# EAGLE design FT232_DIP (EAGLE 5.06)
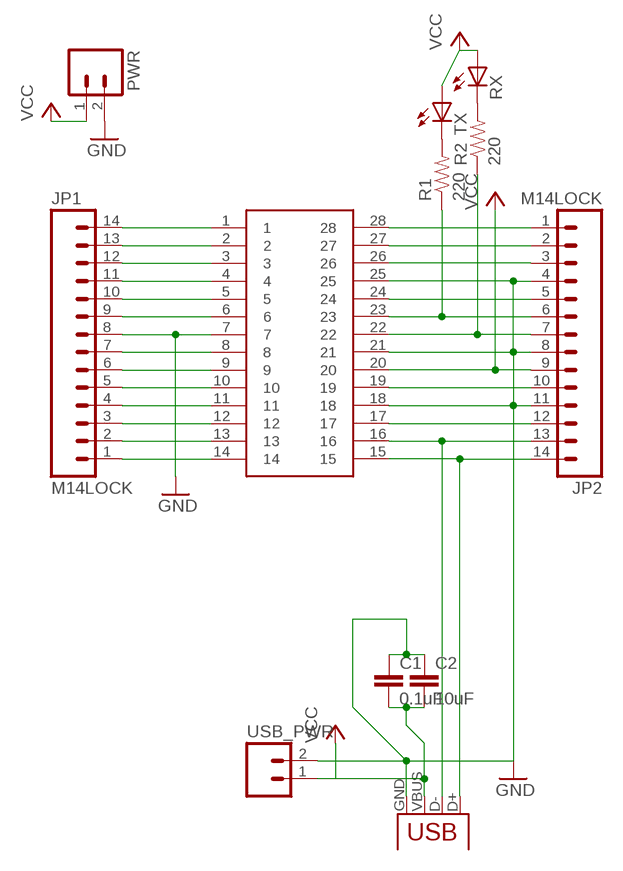
[diagram p0: schematic, sheet 1]

## Parts
C1  0.1uF  CAP0603-CAP  [0603-CAP]
C2  10uF  CAP0603-CAP  [0603-CAP]
JP1  M14LOCK  [1X14_LOCK]
JP2  M14LOCK  [1X14_LOCK]
PWR  M02LOCK  [1X02_LOCK]
R1  220  RESISTOR0603-RES  [0603-RES]
R2  220  RESISTOR0603-RES  [0603-RES]
RX  LED0603  [LED-0603]
TX  LED0603  [LED-0603]
U$1  SSOP28  [SSOP28DB]
USB_PWR  M02LOCK  [1X02_LOCK]
X1  USBSMD  [USB-MINIB]

## Nets
GND: C1.1 C2.1 JP1.8 JP2.4 JP2.8 JP2.11 PWR.2 U$1.7 U$1.18 U$1.21 U$1.25 USB_PWR.2 X1.GND
N$1: JP2.14 U$1.15 X1.D+
N$2: JP2.13 U$1.16 X1.D-
N$3: JP2.7 R2.1 U$1.22
N$5: JP1.1 U$1.14
N$6: JP1.2 U$1.13
N$7: JP1.3 U$1.12
N$8: JP1.4 U$1.11
N$9: JP1.5 U$1.10
N$10: JP1.6 U$1.9
N$11: JP1.7 U$1.8
N$12: JP1.9 U$1.6
N$13: JP1.10 U$1.5
N$14: JP1.11 U$1.4
N$15: JP1.12 U$1.3
N$16: JP1.13 U$1.2
N$17: JP1.14 U$1.1
N$18: JP2.1 U$1.28
N$19: JP2.2 U$1.27
N$20: JP2.3 U$1.26
N$21: JP2.5 U$1.24
N$22: JP2.6 R1.1 U$1.23
N$23: JP2.10 U$1.19
N$24: JP2.12 U$1.17
N$26: R1.2 TX.C
N$27: R2.2 RX.C
VCC: C1.2 C2.2 JP2.9 PWR.1 RX.A TX.A U$1.20 USB_PWR.1 X1.VBUS

## Library data of the parts
C1 C2 = SparkFun:CAP: Capacitor Standard 0603 ceramic capacitor, and 0.1" leaded capacitor.
JP1 JP2 = SparkFun:M14: Header 14 Standard 14-pin 0.1" header. Use with straight break away headers (SKU : PRT-00116), right angle break away headers (PRT-00553), swiss pins (PRT-00743), machine pins (PRT-00117), and female headers (PRT-00115).
PWR USB_PWR = SparkFun:M02: Header 2 Standard 2-pin 0.1" header. Use with straight break away headers (SKU : PRT-00116), right angle break away headers (PRT-00553), swiss pins (PRT-00743), machine pins (PRT-00117), and female headers (PRT-00115). Molex polarized connector foot print use with SKU : PRT-08233 with associated crimp pins and housings.
R1 R2 = SparkFun:RESISTOR: Resistor Basic schematic elements and footprints for 0603, 1206, and PTH 1/10th watt (small) resistors.
RX TX = SparkFun:LED: LEDs Standard schematic elements and footprints for 5mm, 3mm, 1206, and 0603 sized LEDs. 5mm - Spark Fun Electronics SKU : COM-00529 (and others)
U$1 = SparkFun:SSOP28
X1 = SparkFun:USB: USB Connectors USB-B-PTH is fully proven SKU : PRT-00139 USB-miniB is fully proven SKU : PRT-00587 USB-A-PCB is untested. USB-A-H is throughly reviewed, but untested. Spark Fun Electronics SKU : PRT-00437 USB-B-SMT is throughly reviewed, but untested. Needs silkscreen touching up. USB-A-S has not been used/tested USB-MB-H has not been used/tested

## Board
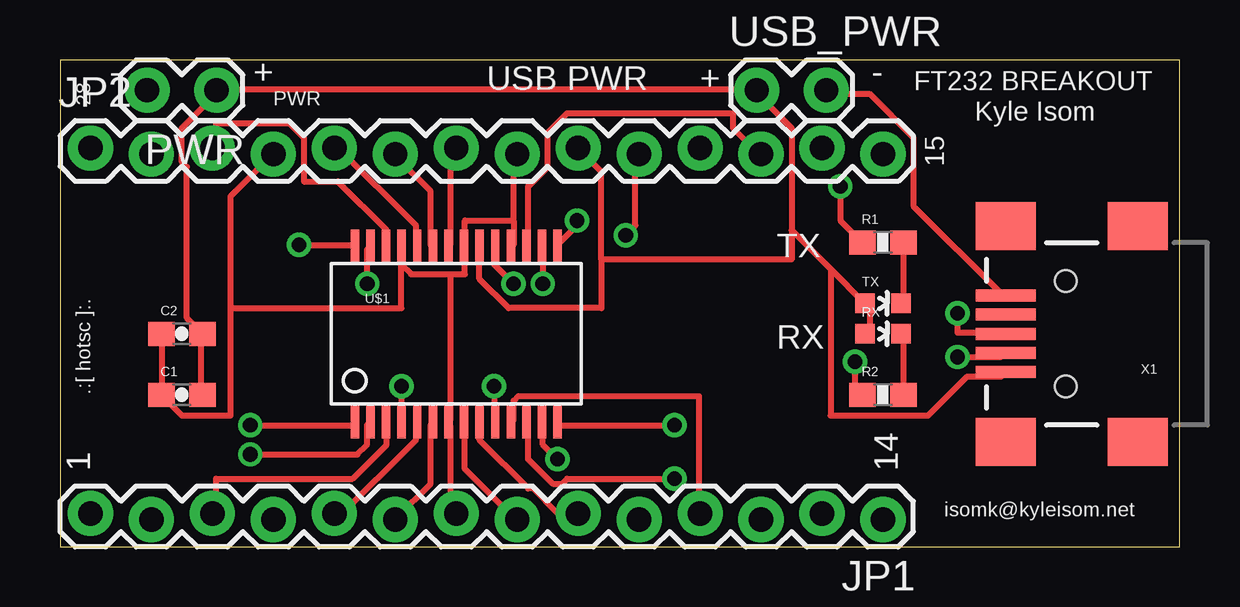
[diagram p1: board, top side]
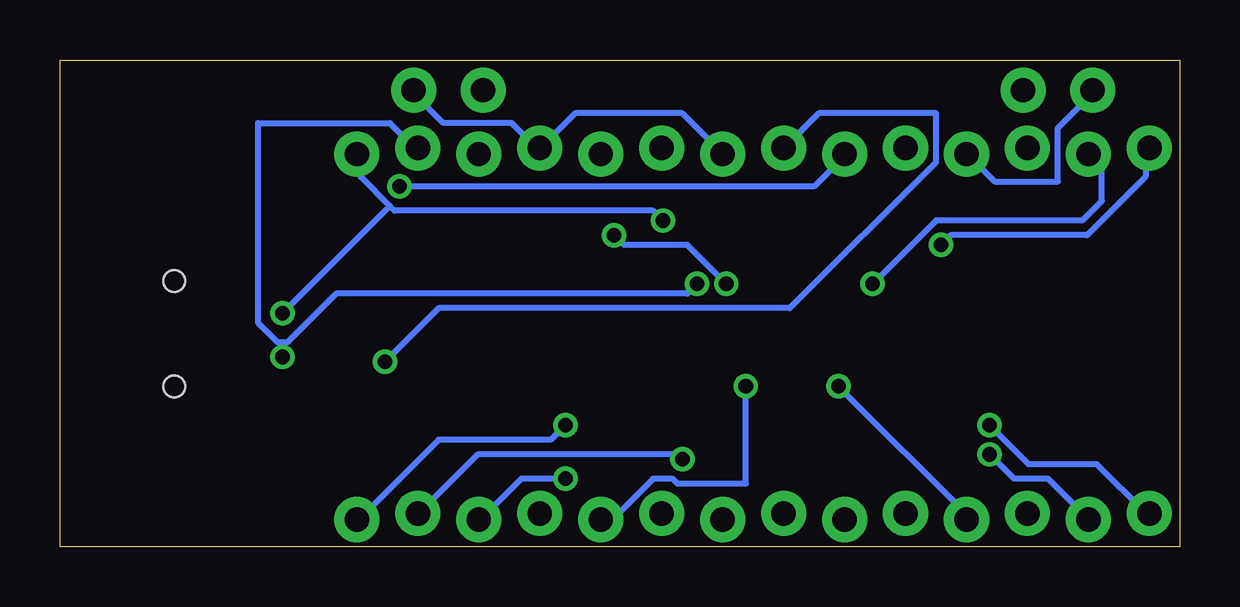
[diagram p2: board, bottom side, seen from below]

Size 46.66 x 20.31 mm. Coordinates in mm from the lower left corner, seen from the top.
Outline: 0,0 46.66,0 46.66,20.31 0,20.31 0,0
Copper layers (1*16): Top 0.035mm / dielectric 1.5mm / Bottom 0.035mm
Design rules "default": minimum track width 10mil, minimum drill 24mil, track to track 8mil, track to pad 8mil, pad to pad 8mil, via to via 8mil, smd to smd 8mil, copper to edge 40mil, drill to drill 8mil, minimum pad ring 10mil, minimum via ring 8mil, stop-mask expansion 4mil, vias tented up to drill 0mil, thermal gap 10mil

### Footprints (pad centres in the part's own frame; a part is rotated, then mirrored left to right if it is on the bottom)
0603-CAP = smd 1.1 x 1: 1 -0.85,0; 2 0.85,0
1X14_LOCK = drill 1.016 pad 1.88 round: 1 0,0.127; 2 2.54,-0.127; 3 5.08,0.127; 4 7.62,-0.127; 5 10.16,0.127; 6 12.7,-0.127; 7 15.24,0.127; 8 17.78,-0.127; 9 20.32,0.127; 10 22.86,-0.127; 11 25.4,0.127; 12 27.94,-0.127; 13 30.48,0.127; 14 33.02,-0.127
1X02_LOCK = drill 1.016 pad 1.88 round: 1 -0.178,0; 2 2.718,0
0603-RES = smd 1.1 x 1: 1 -0.85,0; 2 0.85,0
LED-0603 = smd 0.8 x 0.8: A 0,-0.75; C 0,0.75
SSOP28DB = smd 0.348 x 1.397: 1 -4.225,-3.656; 2 -3.575,-3.656; 3 -2.925,-3.656; 4 -2.275,-3.656; 5 -1.625,-3.656; 6 -0.975,-3.656; 7 -0.325,-3.656; 8 0.325,-3.656; 9 0.975,-3.656; 10 1.625,-3.656; 11 2.275,-3.656; 12 2.925,-3.656; 13 3.575,-3.656; 14 4.225,-3.656; 15 4.225,3.656; 16 3.575,3.656; 17 2.925,3.656; 18 2.275,3.656; 19 1.625,3.656; 20 0.975,3.656; 21 0.325,3.656; 22 -0.325,3.656; 23 -0.975,3.656; 24 -1.625,3.656; 25 -2.275,3.656; 26 -2.925,3.656; 27 -3.575,3.656; 28 -4.225,3.656
USB-MINIB = smd 2.5 x 0.5: D+ 2.5,0; D- 2.5,0.8; GND 2.5,-1.6; ID 2.5,-0.8; VBUS 2.5,1.6 | smd 2.5 x 2: GND@1 -3,-4.5; GND@2 -3,4.5; GND@3 2.5,4.5; GND@4 2.5,-4.5 | hole 0.9: 0,2.2; 0,-2.2

### Placement (x,y rotation side)
C1  5.08,6.35 0 top
C2  5.08,8.89 0 top
JP1  34.29,1.27 180 top
JP2  1.27,16.51 0 top
PWR  6.35,19.05 180 top
R1  34.29,12.7 0 top
R2  34.29,6.35 0 top
RX  34.29,8.89 270 top
TX  34.29,10.16 270 top
U$1  16.51,8.89 0 top
USB_PWR  29.21,19.05 0 top
X1  41.91,8.89 180 top

### Tracks (layer width: path | path; a pad name or v marks a point on that pad's centre or on a via)
GND
  Top 0.254: X1.GND 39.22,10.57 35.56,14.22 35.56,17.07 33.73,18.9 32.11,18.9 USB_PWR.2 | C2.1 4.27,8.74 4.27,6.5 C1.1 4.27,6.3 5.08,5.49 7.11,5.49 7.11,9.96 | 7.11,9.96 7.11,14.63 8.74,16.26 JP2.4 | 18.9,13.61 18.9,16.26 JP2.8 | 18.9,13.61 18.9,12.6 U$1.18 | 14.22,11.79 14.22,12.39 U$1.25 | 14.22,11.79 14.63,11.38 16.26,11.38 | 16.26,11.38 16.87,11.38 16.87,12.39 U$1.21 16.87,12.6 16.87,13.61 18.9,13.61 | 16.26,11.38 16.26,5.28 U$1.7 16.26,5.08 16.26,1.63 16.46,1.42 JP1.8 | 7.11,9.96 14.22,9.96 14.22,11.79
  Bottom 0.254: USB_PWR.2 31.9,18.9 30.68,17.68 27.84,17.68 26.82,16.66 JP2.11 26.62,16.66 25.2,18.09 20.73,18.09 19.1,16.46 JP2.8 | PWR.2 3.66,18.9 5.08,17.48 5.08,15.24 7.72,15.24 8.74,16.26 JP2.4
N$1  (via drill 0.61)
  Top 0.254: v21.54,13.61 21.54,13.41 20.73,12.6 U$1.15 | v37.39,9.75 37.39,8.94 39.22,8.94 X1.D+
  Bottom 0.254: v21.54,13.61 21.95,14.02 32.72,14.02 32.92,14.22 | 32.92,14.22 34.14,15.44 34.14,16.26 JP2.14 | 32.92,14.22 v37.39,9.75
N$2  (via drill 0.61)
  Top 0.254: v20.12,10.97 20.12,12.39 U$1.16 | v37.39,7.92 39.22,7.92 X1.D-
  Bottom 0.254: v20.12,10.97 20.52,10.57 35.15,10.57 37.19,8.53 37.39,8.53 | 37.39,8.53 37.59,8.53 38.41,9.35 38.41,17.68 32.92,17.68 31.9,16.66 JP2.13 | 37.39,8.53 v37.39,7.92
N$3  (via drill 0.61)
  Top 0.254: v33.12,7.72 33.12,6.71 33.33,6.5 R2.1 | U$1.22 16.26,12.6 16.26,16.26 16.46,16.46 JP2.7
  Bottom 0.254: v33.12,7.72 30.89,9.96 16.26,9.96 10.16,16.05 10.16,18.09 15.04,18.09 16.46,16.66 JP2.7
N$5  (via drill 0.61)
  Top 0.254: v25.6,5.08 20.73,5.08 U$1.14
  Bottom 0.254: v25.6,5.08 26.21,4.47 30.89,4.47 34.14,1.22 JP1.1
N$6  (via drill 0.61)
  Top 0.254: v20.73,3.66 20.12,4.27 20.12,5.08 U$1.13
  Bottom 0.254: v20.73,3.66 20.93,3.86 29.26,3.86 31.7,1.42 JP1.2
N$7  (via drill 0.61)
  Top 0.254: v25.6,2.85 21.13,2.85 20.93,2.64 20.52,2.64 19.51,3.66 19.51,5.08 U$1.12
  Bottom 0.254: v25.6,2.85 27.43,2.85 29.06,1.22 JP1.3
N$8
  Top 0.254: U$1.11 18.9,5.28 18.9,6.1 19.1,6.3 26.62,6.3 26.62,1.42 JP1.4
N$9  (via drill 0.61)
  Top 0.254: v18.09,6.71 18.09,5.28 U$1.10
  Bottom 0.254: v18.09,6.71 18.09,2.64 20.93,2.64 21.13,2.85 21.95,2.85 23.57,1.22 23.98,1.22 JP1.5
N$10
  Top 0.254: U$1.9 17.48,5.08 17.48,4.47 19.51,2.44 19.71,2.44 20.73,1.42 21.54,1.42 JP1.6
N$11
  Top 0.254: U$1.8 16.87,5.08 16.87,3.25 18.9,1.22 JP1.7
N$12
  Top 0.254: U$1.6 15.44,5.08 15.44,2.64 14.02,1.22 JP1.9
N$13
  Top 0.254: U$1.5 14.83,5.08 14.83,4.47 11.58,1.22 JP1.10
N$14  (via drill 0.61)
  Top 0.254: v14.22,6.71 14.22,5.28 U$1.4
  Bottom 0.254: v14.22,6.71 8.74,1.22 JP1.11
N$15
  Top 0.254: U$1.3 13.61,5.08 13.61,4.27 12.19,2.85 6.5,2.85 6.5,1.42 JP1.12
N$16  (via drill 0.61)
  Top 0.254: v7.92,3.86 12.39,3.86 12.8,4.27 12.8,5.08 U$1.2
  Bottom 0.254: v7.92,3.86 6.91,2.85 5.49,2.85 3.86,1.22 JP1.13
N$17  (via drill 0.61)
  Top 0.254: v7.92,5.08 12.19,5.08 U$1.1
  Bottom 0.254: v7.92,5.08 6.3,3.45 3.45,3.45 1.42,1.42 JP1.14
N$18  (via drill 0.61)
  Top 0.254: v9.96,12.6 12.19,12.6 U$1.28
  Bottom 0.254: v9.96,12.6 9.55,13.01 3.86,13.01 1.42,15.44 1.42,16.46 JP2.1
N$19  (via drill 0.61)
  Top 0.254: v12.8,10.97 12.8,12.39 U$1.27
  Bottom 0.254: v12.8,10.97 10.16,13.61 4.06,13.61 3.25,14.43 3.25,16.26 3.66,16.26 JP2.2
N$20
  Top 0.254: U$1.26 13.61,12.6 13.61,13.21 11.58,15.24 10.16,15.24 10.16,17.07 9.55,17.68 6.5,17.68 6.5,16.66 JP2.3
N$21
  Top 0.254: U$1.24 14.83,12.6 14.83,13.41 11.58,16.66 JP2.5
N$22  (via drill 0.61)
  Top 0.254: v32.51,15.04 32.51,13.61 33.33,12.8 R1.1 | U$1.23 15.44,12.6 15.44,14.83 14.02,16.26 JP2.6
  Bottom 0.254: v32.51,15.04 15.24,15.04 14.02,16.26 JP2.6
N$23  (via drill 0.61)
  Top 0.254: v18.9,10.97 18.09,11.79 18.09,12.39 U$1.19 | v23.57,13.01 23.98,13.41 23.98,16.26 JP2.10
  Bottom 0.254: v18.9,10.97 20.52,12.6 23.16,12.6 v23.57,13.01
N$24
  Top 0.254: U$1.17 19.51,12.6 19.51,15.04 20.32,15.85 20.32,17.27 21.13,18.09 28.04,18.09 28.04,17.48 29.06,16.46 JP2.12
N$26
  Top 0.254: TX.C 35.15,10.16 35.15,12.6 R1.2
N$27
  Top 0.254: RX.C 35.15,8.74 35.15,6.5 R2.2
VCC
  Top 0.254: C1.2 5.89,6.5 5.89,8.74 C2.2 5.89,8.94 5.28,9.55 5.28,15.85 5.08,16.05 5.08,17.48 6.5,18.9 PWR.1 6.71,19.1 28.85,19.1 USB_PWR.1 29.06,18.9 30.48,17.48 30.48,13.21 | 22.55,11.99 22.55,15.65 21.74,16.46 JP2.9 | 22.55,11.99 22.55,9.96 18.69,9.96 17.48,11.18 17.48,12.39 U$1.20 | RX.A 33.73,8.94 33.73,10.16 TX.A 33.53,10.16 32.11,11.58 | 30.48,13.21 32.11,11.58 | 32.11,11.58 32.11,5.49 36.17,5.49 37.8,7.11 39.22,7.11 X1.VBUS | 22.55,11.99 30.48,11.99 30.48,13.21

### Text on the board
tPlace: - | + | - | USB PWR | + | FT232 BREAKOUT | 28 | PWR | Kyle Isom | 15 | TX | RX | .:[ hotsc ]:. | 1 | 14 | isomk@kyleisom.net